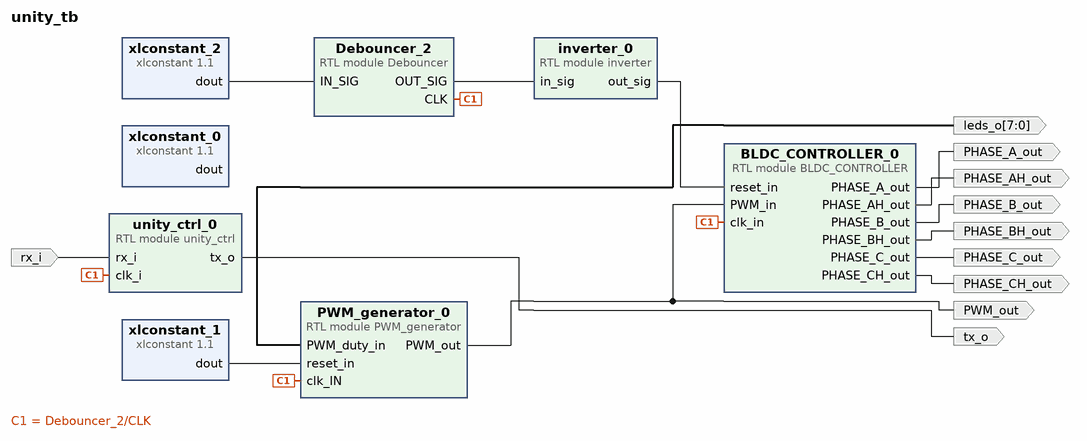
[diagram p0: block diagram of the top level]
# Vivado block design unity_tb, xc7z010clg225-1, Vivado 2016.3
create_bd_design unity_tb

create_bd_port -dir O PHASE_AH_out
create_bd_port -dir O PHASE_A_out
create_bd_port -dir O PHASE_BH_out
create_bd_port -dir O PHASE_B_out
create_bd_port -dir O PHASE_CH_out
create_bd_port -dir O PHASE_C_out
create_bd_port -dir O PWM_out
create_bd_port -dir I rx_i
create_bd_port -dir O -from 7 -to 0 leds_o
create_bd_port -dir O tx_o

create_bd_cell -type ip -vlnv xilinx.com:ip:xlconstant:1.1 xlconstant_0
create_bd_cell -type ip -vlnv xilinx.com:ip:xlconstant:1.1 xlconstant_1
set_property -dict {CONFIG.CONST_VAL 0} [get_bd_cells xlconstant_1]
create_bd_cell -type ip -vlnv xilinx.com:ip:xlconstant:1.1 xlconstant_2
set_property -dict {CONFIG.CONST_VAL 0} [get_bd_cells xlconstant_2]
create_bd_cell -type module -reference Debouncer Debouncer_2
set_property -dict {CONFIG.THRESHOLD 100000} [get_bd_cells Debouncer_2]
create_bd_cell -type module -reference inverter inverter_0
create_bd_cell -type module -reference PWM_generator PWM_generator_0
create_bd_cell -type module -reference unity_ctrl unity_ctrl_0
create_bd_cell -type module -reference BLDC_CONTROLLER BLDC_CONTROLLER_0

# ---- connections ----

connect_bd_net [get_bd_pins BLDC_CONTROLLER_0/PHASE_AH_out] [get_bd_ports PHASE_AH_out]
connect_bd_net [get_bd_pins BLDC_CONTROLLER_0/PHASE_A_out] [get_bd_ports PHASE_A_out]
connect_bd_net [get_bd_pins BLDC_CONTROLLER_0/PHASE_BH_out] [get_bd_ports PHASE_BH_out]
connect_bd_net [get_bd_pins BLDC_CONTROLLER_0/PHASE_B_out] [get_bd_ports PHASE_B_out]
connect_bd_net [get_bd_pins BLDC_CONTROLLER_0/PHASE_CH_out] [get_bd_ports PHASE_CH_out]
connect_bd_net [get_bd_pins BLDC_CONTROLLER_0/PHASE_C_out] [get_bd_ports PHASE_C_out]
connect_bd_net [get_bd_pins Debouncer_2/OUT_SIG] [get_bd_pins inverter_0/in_sig]
connect_bd_net [get_bd_pins PWM_generator_0/PWM_out] [get_bd_ports PWM_out] [get_bd_pins BLDC_CONTROLLER_0/PWM_in]
connect_bd_net [get_bd_pins inverter_0/out_sig] [get_bd_pins BLDC_CONTROLLER_0/reset_in]
connect_bd_net [get_bd_ports rx_i] [get_bd_pins unity_ctrl_0/rx_i]
connect_bd_net -net unity_ctrl_0_leds_o [get_bd_ports leds_o] [get_bd_pins PWM_generator_0/PWM_duty_in]
connect_bd_net [get_bd_pins unity_ctrl_0/tx_o] [get_bd_ports tx_o]
# net xlconstant_0_dout1 has one end: xlconstant_0/dout
connect_bd_net [get_bd_pins xlconstant_1/dout] [get_bd_pins PWM_generator_0/reset_in]
connect_bd_net [get_bd_pins xlconstant_2/dout] [get_bd_pins Debouncer_2/IN_SIG]
connect_bd_net -net clk_1 [get_bd_pins Debouncer_2/CLK] \
  [get_bd_pins PWM_generator_0/clk_IN] [get_bd_pins unity_ctrl_0/clk_i] [get_bd_pins BLDC_CONTROLLER_0/clk_in]

validate_bd_design
save_bd_design
